# Altium schematic sheet INTERFACE.SchDoc
size Letter; SheetNumber: 3; SheetTotal: 4
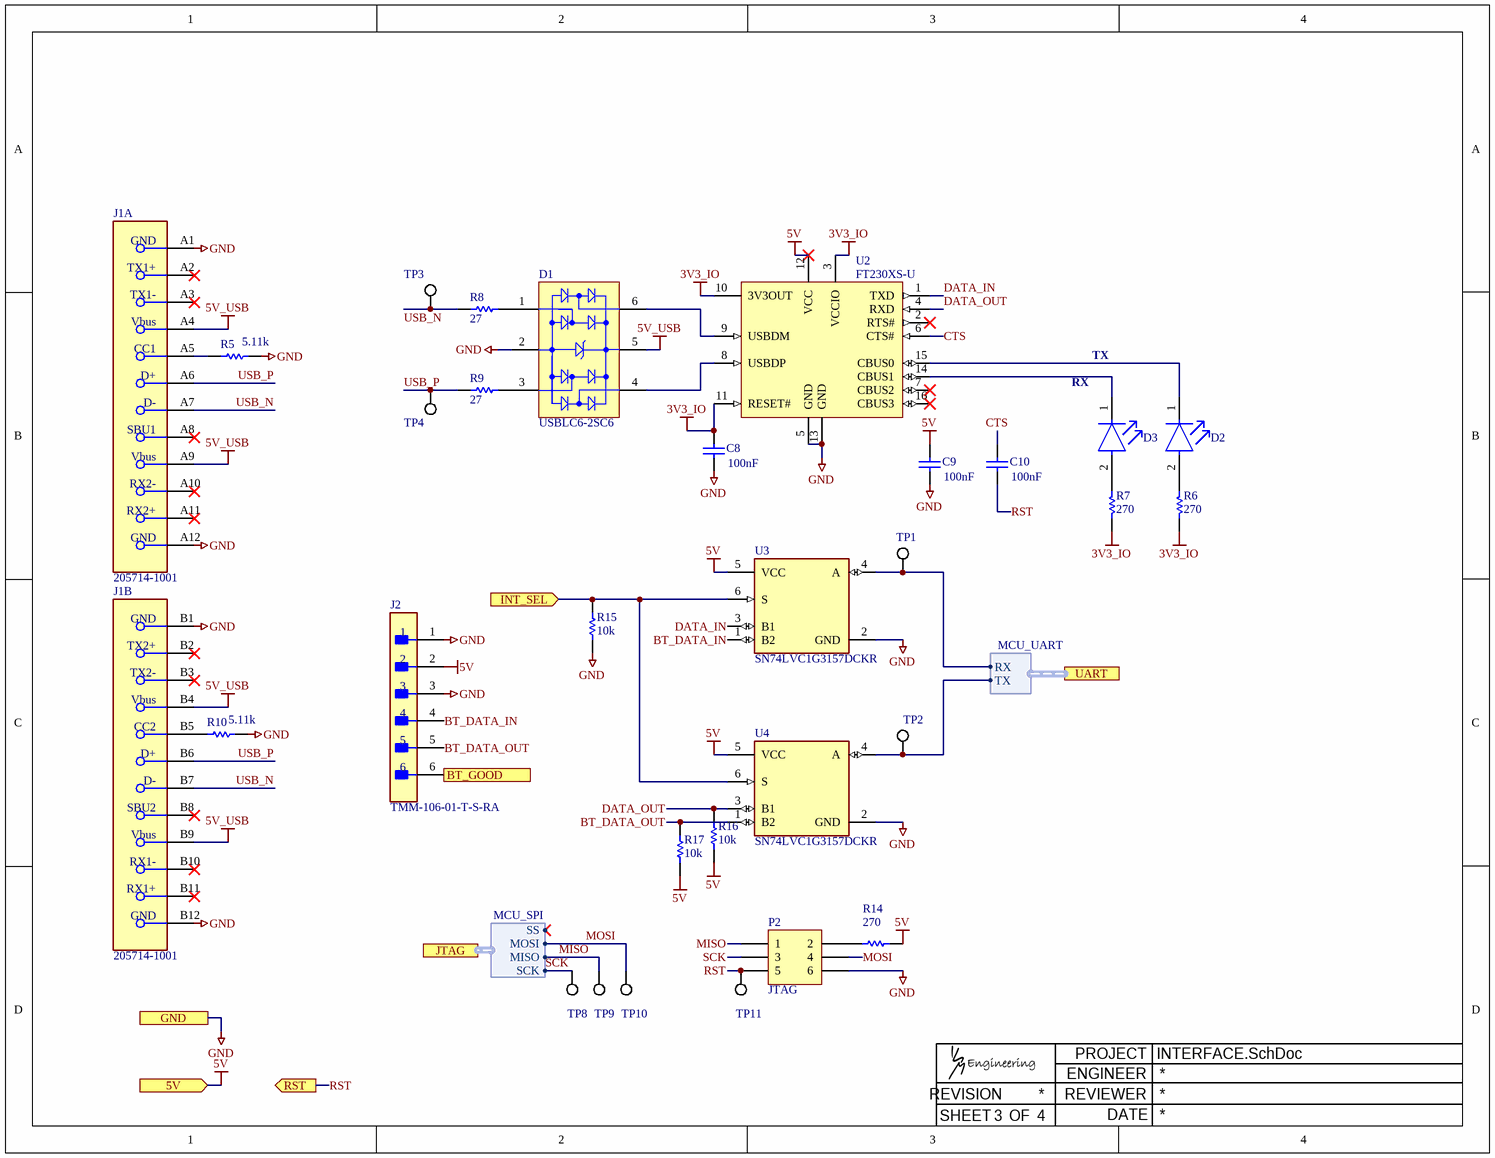
[diagram p0: INTERFACE.SchDoc]

## Parts
C8  100nF  [CAPC1005X56X25ML10T15]
C9  100nF  [CAPC1005X56X25ML10T15]
C10  100nF  [CAPC1005X56X25ML10T15]
D1  USBLC6-2SC6  [STM-SOT23-6L_V]
D2  LTST-C190KGKT  [FP-LTST-C190KGKT-MFG]  (value not drawn)
D3  LTST-C190KGKT  [FP-LTST-C190KGKT-MFG]  (value not drawn)
J1  205714-1001  [FP-205714-1001-MFG]  (parts A,B of 3)
J2  TMM-106-01-T-S-RA  [FP-TMM-106-01-T-S-RA-MFG]
P2  MHDR2X3  [MHDR2X3]  (value not drawn)
R5  5.11k  [RESC1005X40X25NL05T05]
R6  270  [RESC1005X40X25NL05T05]
R7  270  [RESC1005X40X25NL05T05]
R8  27  [RESC1005X40X25LL10T10]
R9  27  [RESC1005X40X25LL10T10]
R10  5.11k  [RESC1005X40X25NL05T05]
R14  270  [RESC1005X40X25NL05T05]
R15  10k  [RESC1005X40X25LL05T05]
R16  10k  [RESC1005X40X25LL05T05]
R17  10k  [RESC1005X40X25LL05T05]
TP1  5019  [KSTN-5019_V]  (value not drawn)
TP2  5019  [KSTN-5019_V]  (value not drawn)
TP3  5019  [KSTN-5019_V]  (value not drawn)
TP4  5019  [KSTN-5019_V]  (value not drawn)
TP8  5019  [KSTN-5019_V]  (value not drawn)
TP9  5019  [KSTN-5019_V]  (value not drawn)
TP10  5019  [KSTN-5019_V]  (value not drawn)
TP11  5019  [KSTN-5019_V]  (value not drawn)
U2  FT230XS-U  [SSOP-16_N]
U3  SN74LVC1G3157DCKR  [FP-DCK0006A-IPC_B]
U4  SN74LVC1G3157DCKR  [FP-DCK0006A-IPC_B]

## Ports
5V (in), BT_GOOD (out), GND, INT_SEL (in), JTAG (harness MCU_SPI), RST (out), UART (harness MCU_UART)

## Harnesses
MCU_SPI: MISO, SCK, MOSI, SS
MCU_UART: RX, TX

## Nets
3V3_IO: C8.2 R6.2 R7.2 U2.3(VCCIO) U2.10(3V3OUT) U2.11(RESET#)
5V: C9.2 J2.2 R14.1 R16.1 R17.1 U2.12(VCC) U3.5(VCC) U4.5(VCC) ; port 5V
5V_USB: D1.5(VBUS) J1.A4(Vbus) J1.A9(Vbus) J1.B4(Vbus) J1.B9(Vbus)
GND: C8.1 C9.1 D1.2(GND) J1.A1(GND) J1.A12(GND) J1.B1(GND) J1.B12(GND) J2.1 J2.3 P2.6 R5.1 R10.1 R15.2 U2.5(GND) U2.13(GND) U3.2(GND) U4.2(GND) ; port GND
BT_DATA_IN: J2.4 U3.1(B2)
BT_DATA_OUT: J2.5 R17.2 U4.1(B2)
BT_GOOD: J2.6 ; port BT_GOOD
CTS: C10.2 U2.6(CTS#)
DATA_IN: U2.1(TXD) U3.3(B1)
DATA_OUT: R16.2 U2.4(RXD) U4.3(B1)
INT_SEL: R15.1 U3.6(S) U4.6(S) ; port INT_SEL
MISO: P2.1 TP9.1 ; port JTAG.MISO
MOSI: P2.4 TP10.1 ; port JTAG.MOSI
RST: C10.1 P2.5 TP11.1 ; port RST
SCK: P2.3 TP8.1 ; port JTAG.SCK
USB_N: J1.A7(D-) J1.B7(D-) R8.1 TP3.1
USB_P: J1.A6(D+) J1.B6(D+) R9.1 TP4.1
NetD1_1: D1.1(I/O_1) R8.2
NetD1_3: D1.3(I/O_2) R9.2
NetD1_4: D1.4(I/O_3) U2.8(USBDP)
NetD1_6: D1.6(I/O_4) U2.9(USBDM)
NetD2_1: D2.1(C) U2.15(CBUS0)
NetD2_2: D2.2(A) R6.1
NetD3_1: D3.1(C) U2.14(CBUS1)
NetD3_2: D3.2(A) R7.1
NetJ1_A5: J1.A5(CC1) R5.2
NetJ1_B5: J1.B5(CC2) R10.2
NetP2_2: P2.2 R14.2
NetTP1_1: TP1.1 U3.4(A) ; port UART.RX
NetTP2_1: TP2.1 U4.4(A) ; port UART.TX

Not connected (* = marked no-connect by the designer): J1 A2(TX1+)* A3(TX1-)* A8(SBU1)* A10(RX2-)* A11(RX2+)* B2(TX2+)* B3(TX2-)* B8(SBU2)* B10(RX1-)* B11(RX1+)*; U2 2(RTS#)* 7(CBUS2)* 16(CBUS3)*

## Notes on the sheet
- TX
- (near D3) RX
- (near P2) JTAG
- SHEET
- REVISION
- OF
- PROJECT
- REVIEWER
- ENGINEER
- DATE

## Library data of the parts
C8-C10 = CMP-1034-02071-2: Manufacturer: AVX Interconnect / Elco; Part Number: 0402YG104ZAT2A
D1 = CMP-2000-05378-1: Very low capacitance ESD protection, 3.5 pF, -40 to 125 degC, 6-Pin SOT23, RoHS, Tape and Reel; Manufacturer: STMicroelectronics; Polarity: Uni-Directional; Clamping Voltage: 17V; Rad Hardened: No; Product Height (mm): 1.3mm; Leakage Current (Max): 0.15uA; Product Length (mm): 3.05mm; Number of Elements: 1; Peak Pulse Current: 5A; Configuration: Dual; Reverse Breakdown Voltage: 6V; Working Voltage (Max): 5V; Capacitance Value: 3.5pF; Suppressor Type: DiodeArrays; Product Depth (mm): 1.75mm; Test Current (It): 1mA; Package / Case: SOT-23; Operating Temperature Max Deg. C: 125C; Package Description: 6-Pin Small Outline Transistor, Body 2.925 x 1.625 mm, Pitch 0.95 mm; Package Reference: SOT23-6L; Datasheet Version: Rev. 5, 10/2011; Operating Temperature Min Deg. C: -40C; Mounting Style: SurfaceMount; Direction Type: Uni-Directional; Mounting: SurfaceMount; Pin Count: 6; Leakage Current: 0.15uA; Packaging: TapeandReel; Operating Temperature Classification: Automotive; Clamping Voltage (Max): 17V; Manufacturer URL: http://www.st.com/; Reverse Stand-off Voltage: 5V; Datasheet URL: http://www.st.com/st-web-ui/static/active/en/resource/technical/document/datasheet/CD00050750.pdf; Working Voltage: 5V; Operating Temp Range: -40Cto125C
D2 D3 = CMP-2000-05197-2: LED GREEN CLEAR CHIP SMD; Test Current: 20mA; Power Rating: 75mW; Forward Voltage: 2V; Wavelength: 574nm; Number of LEDs: 1; Reverse Voltage: 5V; Dominant Wavelength: 571nm; Lens Style: Diffused; Luminous Intensity: 35mcd; Forward Current: 30mA; Viewing Angle: 130°; Lens Color: Colorless; Width: 0.8mm; Case Code (Imperial): 0603; Case Code (Metric): 1608; Number of Pins: 2; Radiation Hardening: No; Package Quantity: 1; Lead Free: Lead Free; Lens Transparency: Clear; Depth: 0.8mm; Power Dissipation: 75mW; Mount: Surface Mount; Max Operating Temperature: 85°C; Case/Package: 0603; Height: 0.8mm; Illumination Color: Green; Color: Green; Length: 1.6mm; Packaging: Tape and Reel; Number of Elements: 1; Min Operating Temperature: -55°C
J1 = CMP-04767-000031-1: USB TYPE C WITH SCREW HOLE  GM
J2 = CMP-02766-001548-1: CONN HEADER R/A 6POS 2MM; Gender: Male; Max Voltage Rating (AC): 500V; Max Current Rating: 3.9A; Number of Positions: 6; Packaging: Bulk; Insulation Color: Black; Contact Type: Male Pin; Series: TMM; Length: 12mm; Termination: Solder; Number of Rows: 1; Housing Material: Polymer; Min Operating Temperature: -55°C; Pitch: 2mm; Contact Shape: Square; Insulation Material: Polymer; Lead Free: Lead Free; Radiation Hardening: No; Depth: 5.97mm; Contact Plating: Tin; Contact Material: Bronze; Housing Color: Black; Orientation: Right Angle; Fastening Type: Pull; RoHS Compliant: Yes; Number of Contacts: 6; Max Operating Temperature: 105°C; Connector Type: Header; Contact Finish - Mating: TIN; REACH SVHC: No SVHC
P2 = MHDR2X3: Header, 3-Pin, Dual row; LatestRevisionDate: 17-Jul-2002; LatestRevisionNote: Re-released for DXP Platform.; Publisher: Altium Limited
R5 R10 = CMP-2002-00974-1: Manufacturer: Panasonic; Part Number: ERJ-2RKF5111X
R6 R7 R14 = CMP-1011-00444-2: Part Number: ERJ2RKF2700X; Manufacturer: Panasonic
R8 R9 = CMP-2002-03638-1: Part Number: RK73B1ETTP270J; Manufacturer: KOA Speer
R15-R17 = CMP-2000-07588-1: Chip Resistor, 10 KOhm, +/- 1%, 0.1 W, -55 to 155 degC, 0402 (1005 Metric), RoHS, Tape and Reel; Manufacturer: Panasonic; Power Rating: 100mW; Voltage Rating: 50V; Resistance: 10KOhm; Case\/Package: 0402; Temperature Coefficient: 100ppm\/degreesC; RoHSCompliant: True; Lead Free: LeadFree; Package Quantity: 1; Contact Plating: Tin; Length: 1mm; Radiation Hardening: No; REACH SVHC: NoSVHC; Max Operating Temperature: 155degC; Depth: 0.5mm; Case Code (Imperial): 0402; Military Standard: Not; Package Description: 2-Pin Surface Mount Device, Body 1 x 0.5 mm; Termination: SMD/SMT; Case Code (Metric): 1005; Height: 0.35mm; Packaging: TapeandReel; Voltage Rating (DC): 50V; Package Reference: 402; Number of Pins: 2; Tolerance: 1%; Mounting Technology: SurfaceMount; Width: 0.02inch; Mount: SurfaceMount; Datasheet URL: https://industrial.panasonic.com/cdbs/www-data/pdf/RDA0000/AOA0000C304.pdf; Composition: ThickFilm; Datasheet Version: 02/2017; Manufacturer URL: http://www.panasonic.com/; Max Power Dissipation: 100mW; Number of Terminations: 2; Min Operating Temperature: -55degC
TP1-TP4 TP8-TP11 = CMP-1672-00008-1: Test Point, 1 Position SMD, RoHS, Tape and Reel; ComponentLink1Description: Manufacturer URL; Package Quantity: 1000; DatasheetVersion: 03/2014; Packaging: Tape and Reel; ComponentLink2URL: http://www.keyelco.com/product-pdf.cfm?p=1357; ComponentLink1URL: http://www.keyelco.com/; Mount: Surface Mount; Contact Plating: Silver; PackageDescription: 1-Pin Surface Mount Device, Body 3.81 x 2.03 mm; Pins: 1; RoHSCompliant: True; Mounting Technology: Surface Mount; ComponentLink2Description: Datasheet; PackageReference: 5019
U2 = CMP-0248-00025-2: USB to Basic UART Interface Chip, UHCI/OHCI/EHCI Compatible, USB 2.0 Compatible, -40 to +85 degC, 16-Pin SSOP, Pb-Free, Tube; Manufacturer: FTDI; PackageDescription: 16-Pin Small Outline Package, 8.6 x 3.9 mm Body, 0.635 mm Pitch; ComponentLink2URL: http://www.ftdichip.com/Support/Documents/DataSheets/ICs/DS_FT230X.pdf; ComponentLink3URL: www.ftdichip.com/Products/ICs/FT230X.html; PartNumber: FT230XS-U; RevisionNote: DatasheetVersion updated to 1.2 Feb-2013; PackageVersion: Feb-13; ComponentLink2Description: Datasheet; Code_JEDEC: MO-137-AB; DatasheetVersion: ver 1.2, Feb-2013; ComponentLink1URL: http://www.ftdichip.com/; PackageReference: SSOP-16; ComponentLink1Description: Manufacturer URL; ComponentLink3Description: FT230X Product Page
U3 U4 = CMP-0859-00516-4: IC SWITCH SPDT SC70-6; Nominal Supply Current: 10uA; Number of Inputs: 1; Supply Type: Single; Operating Supply Current: 1uA; Polarity: Non-Inverting; Low Level Output Current: 128mA; Bandwidth: 300MHz; Max Supply Voltage: 5.5V; Turn-Off Delay Time: 3.8ns; Turn-On Delay Time: 5.7ns; Number of Outputs: 2; Min Supply Voltage: 1.65V; Propagation Delay: 300ps; On-State Resistance: 15R; Mount: Surface Mount; Throw Configuration: SPDT; Min Operating Temperature: -40°C; Radiation Hardening: No; Number of Pins: 6; Case/Package: SC; Length: 2mm; Lead Free: Lead Free; REACH SVHC: No SVHC; Termination: SMD/SMT; High Level Output Current: 128mA; Height: 0.9mm; Weight: 8.8E-05oz; Package Quantity: 3000; Number of Channels: 1; Packaging: Tape and Reel; Number of Bits: 1; Width: 1.25mm; Max Operating Temperature: 125°C; Max Supply Current: 10uA; Contact Plating: Gold; RoHS Compliant: Yes